# Altium schematic sheet [1]-Schematics Blocks.SchDoc
size A4
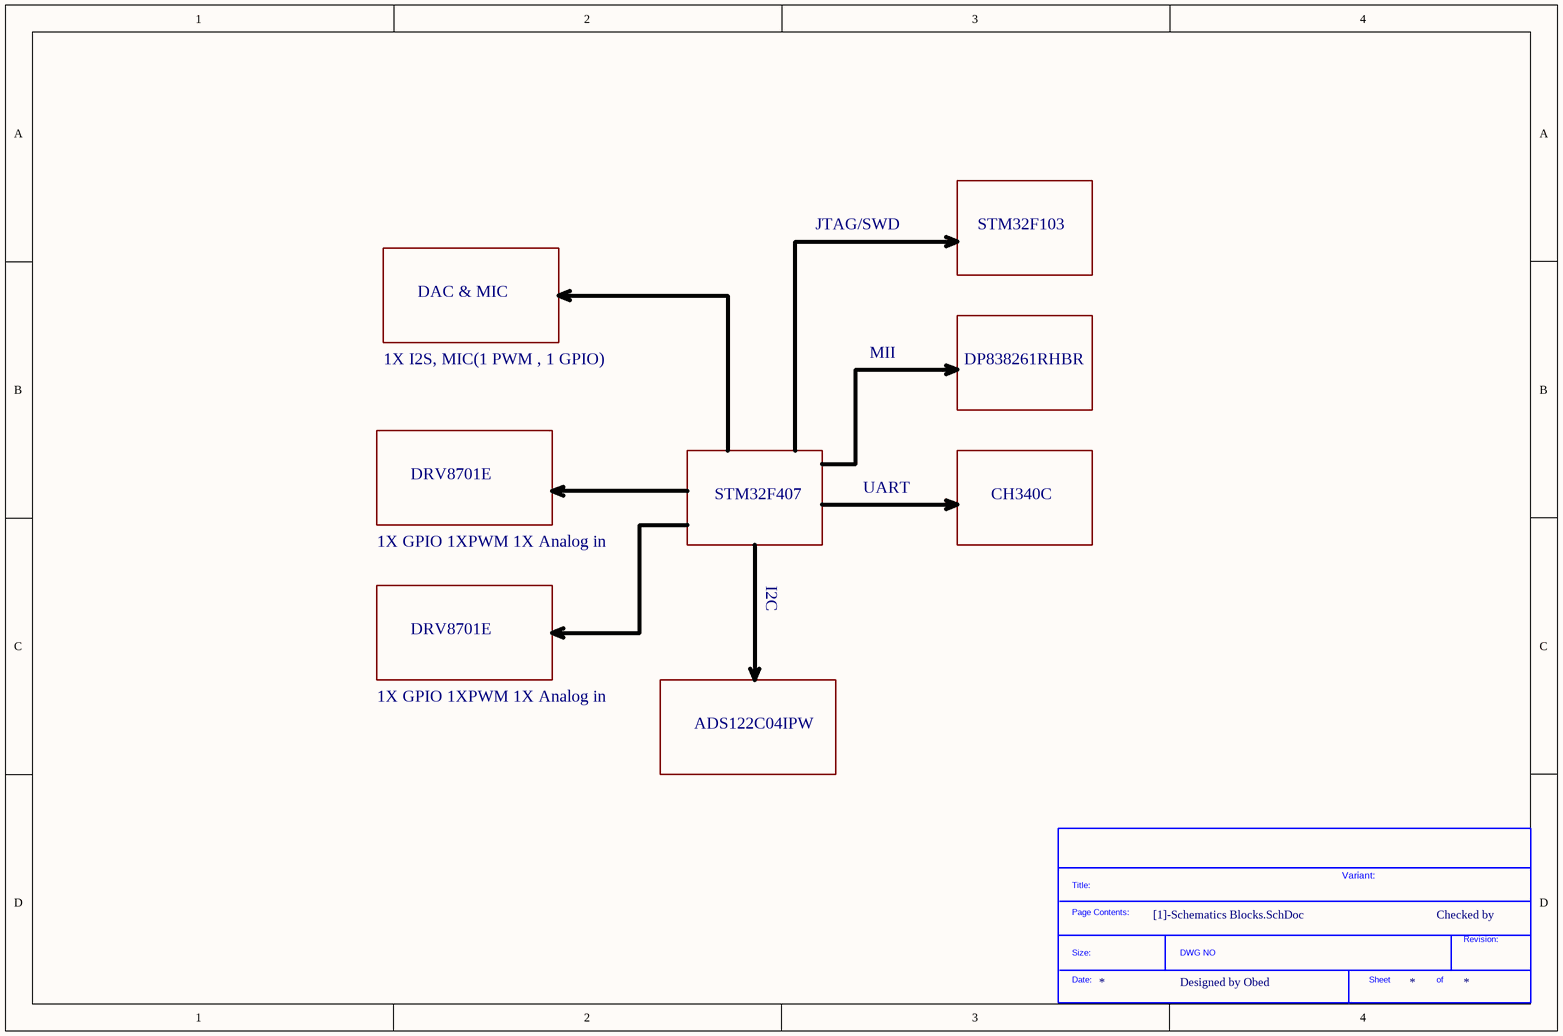
[diagram p0: [1]-Schematics Blocks.SchDoc]

## Parts
*?  SDTitleBlock  (value not drawn)  (graphical)

## Notes on the sheet
- JTAG/SWD
- STM32F103
- DAC & MIC
- 1X I2S, MIC(1 PWM , 1 GPIO)
- MII
- DP838261RHBR
- DRV8701E
- STM32F407
- UART
- CH340C
- 1X GPIO 1XPWM 1X Analog in
- I2C
- ADS122C04IPW
- Variant:
- Checked by
- Designed by Obed
- (in symbol SDTitleBlock) Title:; Page Contents:; Revision:; Size:; DWG NO; Date:; Sheet; of